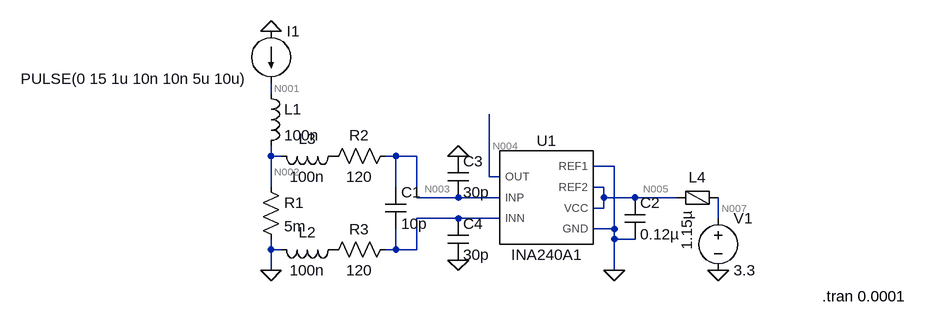
[diagram p0: schematic INA240_test_hell.asc]
INA240_test_hell.asc, the LTspice schematic file:
Version 4.1
SHEET 1 880 680
WIRE -160 16 -160 0
WIRE -160 112 -160 96
WIRE -144 112 -160 112
WIRE 32 112 16 112
WIRE 64 112 32 112
WIRE 368 128 336 128
WIRE 176 144 176 48
WIRE 192 144 176 144
WIRE -160 160 -160 112
WIRE 32 160 32 112
WIRE 352 160 336 160
WIRE 64 176 64 112
WIRE 128 176 64 176
WIRE 192 176 128 176
WIRE 352 176 352 160
WIRE 400 176 352 176
WIRE 464 176 400 176
WIRE 352 192 352 176
WIRE 352 192 336 192
WIRE 128 208 64 208
WIRE 192 208 128 208
WIRE 528 208 528 176
WIRE 368 224 368 128
WIRE 368 224 336 224
WIRE 368 240 368 224
WIRE 400 240 368 240
WIRE -160 256 -160 240
WIRE -144 256 -160 256
WIRE 32 256 32 224
WIRE 32 256 16 256
WIRE 64 256 64 208
WIRE 64 256 32 256
WIRE -160 288 -160 256
WIRE 368 288 368 240
FLAG -160 288 0
FLAG 368 288 0
FLAG 528 288 0
FLAG -160 -80 0
FLAG 128 272 0
FLAG 128 112 0
SYMBOL INA240A1 256 176 R0
SYMATTR InstName U1
SYMBOL res -176 144 R0
SYMATTR InstName R1
SYMATTR Value 5m
SYMBOL current -160 -80 R0
WINDOW 123 0 0 Left 0
WINDOW 39 0 0 Left 0
WINDOW 3 -385 73 Left 2
SYMATTR Value PULSE(0 15 1u 10n 10n 5u 10u)
SYMATTR InstName I1
SYMBOL voltage 528 192 R0
WINDOW 123 0 0 Left 0
WINDOW 39 0 0 Left 0
SYMATTR InstName V1
SYMATTR Value 3.3
SYMBOL res 32 96 R90
WINDOW 0 0 56 VBottom 2
WINDOW 3 32 56 VTop 2
SYMATTR InstName R2
SYMATTR Value 120
SYMATTR SpiceLine tol=1 pwr=0.1
SYMBOL res 32 240 R90
WINDOW 0 0 56 VBottom 2
WINDOW 3 32 56 VTop 2
SYMATTR InstName R3
SYMATTR Value 120
SYMATTR SpiceLine tol=1 pwr=0.1
SYMBOL cap 16 160 R0
SYMATTR InstName C1
SYMATTR Value 10p
SYMATTR SpiceLine V=100 Irms=0 Rser=0 Lser=0
SYMBOL FerriteBead 496 176 R90
WINDOW 0 -16 0 VBottom 2
SYMATTR InstName L4
SYMATTR Value 1.15µ
SYMATTR SpiceLine Ipk=0.1 Rser=0.53 Rpar=760 Cpar=560f mfg="W�rth Elektronik" pn="7427927261 WE-CBF 0402"
SYMBOL cap 384 176 R0
SYMATTR InstName C2
SYMATTR Value 0.12µ
SYMATTR SpiceLine V=10 Irms=787m Rser=0.125741 Lser=0 mfg="KEMET" pn="C0603C124K8RAC" type="X7R"
SYMBOL cap 112 112 R0
SYMATTR InstName C3
SYMATTR Value 30p
SYMATTR SpiceLine V=100 Irms=0 Rser=0 Lser=0
SYMBOL cap 112 208 R0
SYMATTR InstName C4
SYMATTR Value 30p
SYMATTR SpiceLine V=100 Irms=0 Rser=0 Lser=0
SYMBOL ind -176 0 R0
SYMATTR InstName L1
SYMATTR Value 100n
SYMBOL ind -48 240 R90
WINDOW 0 5 56 VBottom 2
WINDOW 3 32 56 VTop 2
SYMATTR InstName L2
SYMATTR Value 100n
SYMBOL ind -48 96 R90
WINDOW 0 5 56 VBottom 2
WINDOW 3 32 56 VTop 2
SYMATTR InstName L3
SYMATTR Value 100n
TEXT 688 328 Left 2 !.tran 0.0001

The netlist it stands for:
* INA240_test_hell.asc
X§U1 N004 N003 N006 0 N005 N005 0 INA240A1  ; pins OUT INP INN REF1 REF2 VCC GND
R1 N002 0 5m
I1 0 N001 PULSE(0 15 1u 10n 10n 5u 10u)
V1 N007 0 3.3
R2 N003 P001 120 tol=1 pwr=0.1
R3 N006 P002 120 tol=1 pwr=0.1
C1 N003 N006 10p V=100 Irms=0 Rser=0 Lser=0
L4 N007 N005 1.15µ Ipk=0.1 Rser=0.53 Rpar=760 Cpar=560f mfg="W�rth Elektronik" pn="7427927261 WE-CBF 0402"
C2 N005 0 0.12µ V=10 Irms=787m Rser=0.125741 Lser=0 mfg="KEMET" pn="C0603C124K8RAC" type="X7R"
C3 0 N003 30p V=100 Irms=0 Rser=0 Lser=0
C4 N006 0 30p V=100 Irms=0 Rser=0 Lser=0
L1 N001 N002 100n
L2 P002 0 100n
L3 P001 N002 100n
.tran 0.0001
.lib C:\GitHub\Robotic_Manipulator_HSPS\hardware\simulations\spice_models\amplifier\INA240\ina240a1.lib
.backanno
.end

* Results of the author's LTspice run, read from the files saved beside the schematic
* Operating Point, zero values left out:
*   V(n004) = 1.65 V
*   V(n005) = 3.299 V
*   V(n007) = 3.3 V
*   I(L4) = 1.833 mA
*   I(V1) = -1.833 mA
*   Ix(u1:gnd) = -1.8 mA
*   Ix(u1:ref1) = -32.99 µA
*   Ix(u1:ref2) = 32.99 µA
*   Ix(u1:vcc) = 1.8 mA
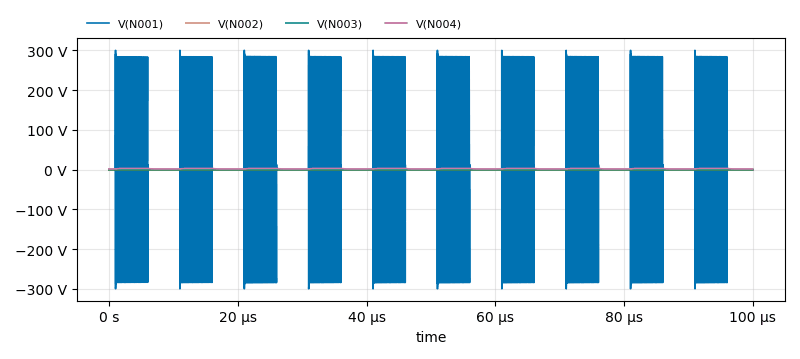
[diagram p1: Transient Analysis of INA240_test_hell.asc, plotted from the saved traces]
* Transient Analysis, 1 run:
*   V(N001): min -299.6 V, max 300 V, average 45.09 mV, rms 201.2 V, last 0 V
*   V(N002): min 0 V, max 75 mV, average 37.57 mV, rms 53.09 mV, last 0 V
*   V(N003): min 0 V, max 74.98 mV, average 37.57 mV, rms 53.04 mV, last 0 V
*   V(N004): min 1.649 V, max 3.149 V, average 2.401 V, rms 2.498 V, last 1.649 V